# Altium schematic sheet RedundantReg.SchDoc
size A4
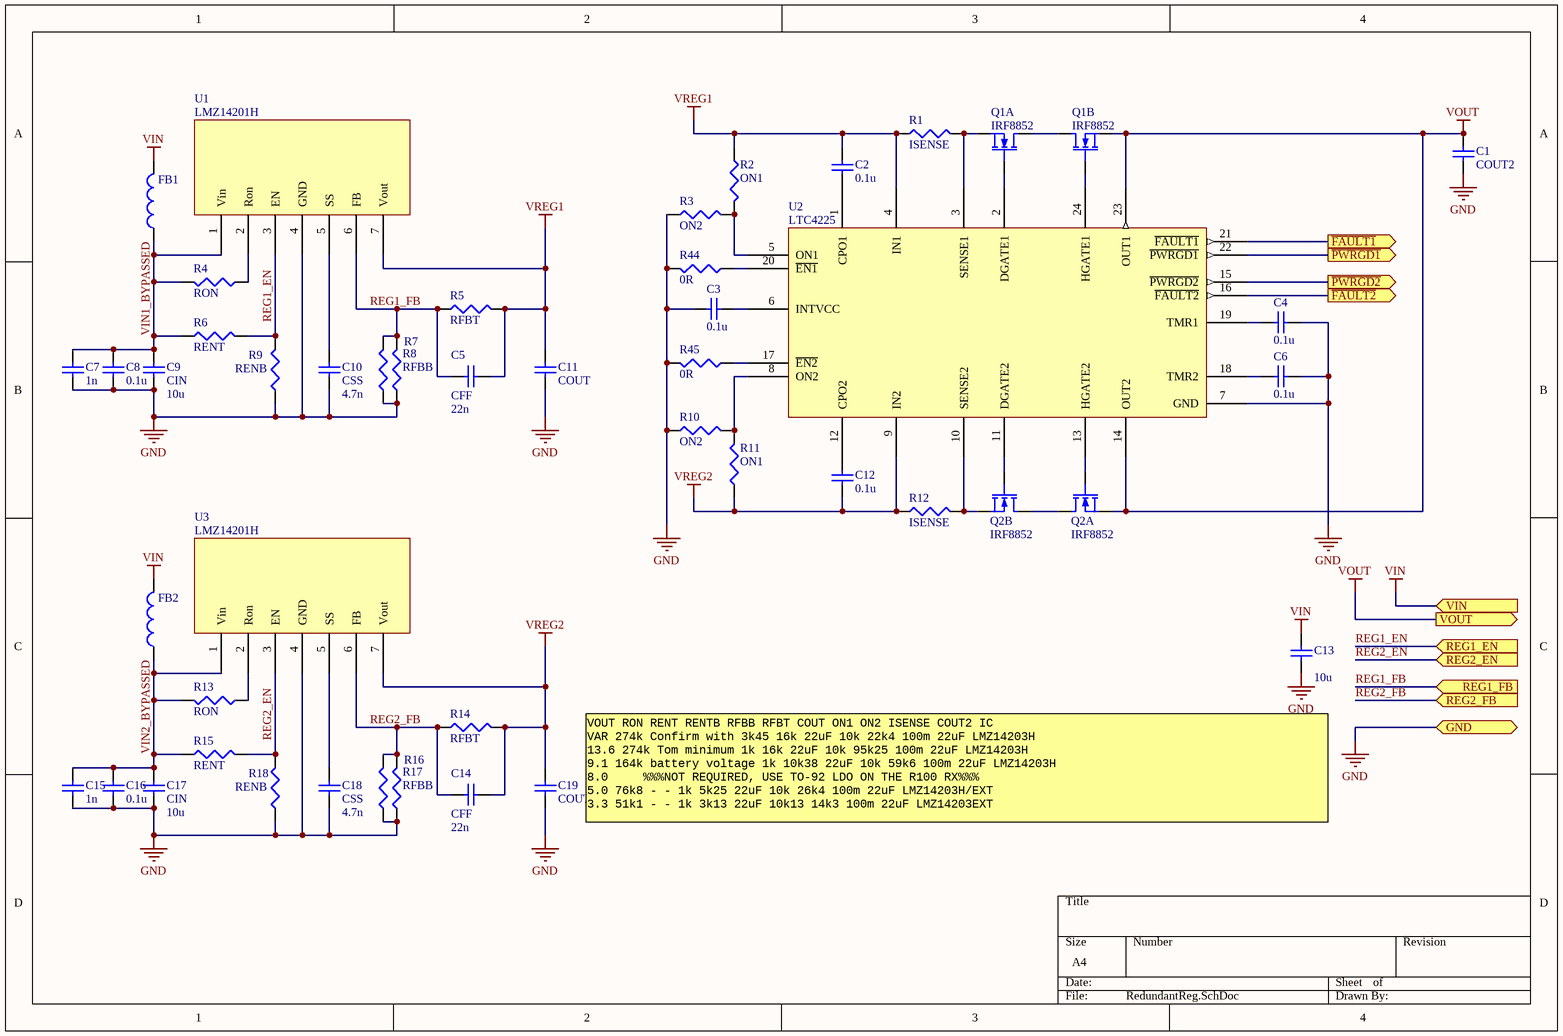
[diagram p0: RedundantReg.SchDoc]

## Parts
C1  COUT2  [R1210M]
C2  value 0.1u  [R0805M]
C3  value 0.1u  [R0805M]
C4  value 0.1u  [R0805M]
C5  CFF  value 22n  [R0805M]
C6  value 0.1u  [R0805M]
C7  value 1n  [R0805M]  (hidden comment: CIN)
C8  value 0.1u  [R0805M]  (hidden comment: CIN)
C9  CIN  value 10u  [R1210M]
C10  CSS  value 4.7n  [R0805M]
C11  COUT  [R1210M]
C12  value 0.1u  [R0805M]
C13  value 10u  [R1210M]
C14  CFF  value 22n  [R0805M]
C15  value 1n  [R0805M]  (hidden comment: CIN)
C16  value 0.1u  [R0805M]  (hidden comment: CIN)
C17  CIN  value 10u  [R1210M]
C18  CSS  value 4.7n  [R0805M]
C19  COUT  [R1210M]
FB1  (no value)  [R0805M]
FB2  (no value)  [R0805M]
Q1  IRF8852  [TSSOP8]  (parts A,B of 2)
Q2  IRF8852  [TSSOP8]  (parts A,B of 2)
R1  ISENSE  [R0805M]
R2  ON1  [R0805M]
R3  ON2  [R0805M]
R4  RON  [R0805M]
R5  RFBT  [R0805M]
R6  RENT  [R0805M]
R7  RFBB  [R0805M]  (value not drawn)
R8  RFBB  [R0805M]
R9  RENB  [R0805M]
R10  ON2  [R0805M]
R11  ON1  [R0805M]
R12  ISENSE  [R0805M]
R13  RON  [R0805M]
R14  RFBT  [R0805M]
R15  RENT  [R0805M]
R16  RFBB  [R0805M]  (value not drawn)
R17  RFBB  [R0805M]
R18  RENB  [R0805M]
R44  value 0R  [R0805M]
R45  value 0R  [R0805M]
U1  LMZ14201H  [TO-PMOD-7]
U2  LTC4225  [SSOP24]
U3  LMZ14201H  [TO-PMOD-7]

## Ports
GND, REG1_EN (in), REG1_FB (in), REG2_EN (in), REG2_FB (in), VIN (in), VOUT (out), ~{FAULT1} (out), ~{FAULT2} (out), ~{PWRGD1} (out), ~{PWRGD2} (out)

## Nets
GND: C1.1 C3.2 C4.1 C6.1 C7.1 C8.1 C9.2 C10.2 C11.1 C13.2 C15.1 C16.1 C17.2 C18.2 C19.1 R3.1 R7.1 R8.1 R9.2 R10.1 R16.1 R17.1 R18.2 R44.2 R45.2 U1.4(GND) U2.7(GND) U3.4(GND) ; port GND
VIN: C13.1 FB1.2 FB2.2 ; port VIN
VOUT: C1.2 Q1.S2(S) Q2.S1(S) U2.14(OUT2) U2.23(OUT1) ; port VOUT
VREG1: C2.1 C5.2 C11.2 R1.1 R2.1 R5.2 U1.7(Vout) U2.4(IN1)
VREG2: C12.2 C14.2 C19.2 R11.1 R12.1 R14.2 U2.9(IN2) U3.7(Vout)
~{FAULT1}: U2.21(~{FAULT1}) ; port ~{FAULT1}
~{FAULT2}: U2.16(~{FAULT2}) ; port ~{FAULT2}
~{PWRGD1}: U2.22(~{PWRGD1}) ; port ~{PWRGD1}
~{PWRGD2}: U2.15(~{PWRGD2}) ; port ~{PWRGD2}
REG1_EN: R6.2 R9.1 U1.3(EN) ; port REG1_EN
REG1_FB: C5.1 R5.1 R7.2 R8.2 U1.6(FB) ; port REG1_FB
REG2_EN: R15.2 R18.1 U3.3(EN) ; port REG2_EN
REG2_FB: C14.1 R14.1 R16.2 R17.2 U3.6(FB) ; port REG2_FB
VIN1_BYPASSED: C7.2 C8.2 C9.1 FB1.1 R4.2 R6.1 U1.1(Vin)
VIN2_BYPASSED: C15.2 C16.2 C17.1 FB2.1 R13.2 R15.1 U3.1(Vin)
NetC2_2: C2.2 U2.1(CPO1)
NetC3_1: C3.1 U2.6(INTVCC)
NetC4_2: C4.2 U2.19(TMR1)
NetC6_2: C6.2 U2.18(TMR2)
NetC10_1: C10.1 U1.5(SS)
NetC12_1: C12.1 U2.12(CPO2)
NetC18_1: C18.1 U3.5(SS)
NetQ1_D1: Q1.D1(D) Q1.D2(D)
NetQ1_G1: Q1.G1(G) U2.2(DGATE1)
NetQ1_G2: Q1.G2(G) U2.24(HGATE1)
NetQ1_S1: Q1.S1(S) R1.2 U2.3(SENSE1)
NetQ2_D1: Q2.D1(D) Q2.D2(D)
NetQ2_G1: Q2.G1(G) U2.13(HGATE2)
NetQ2_G2: Q2.G2(G) U2.11(DGATE2)
NetQ2_S2: Q2.S2(S) R12.2 U2.10(SENSE2)
NetR2_2: R2.2 R3.2 U2.5(ON1)
NetR4_1: R4.1 U1.2(Ron)
NetR10_2: R10.2 R11.2 U2.8(ON2)
NetR13_1: R13.1 U3.2(Ron)
NetR44_1: R44.1 U2.20(~{EN1})
NetR45_1: R45.1 U2.17(~{EN2})

## Notes on the sheet
- VOUT	RON	RENT	RENTB	RFBB	RFBT	COUT	ON1	ON2	ISENSE	COUT2	IC
  VAR	274k	Confirm with	3k45	16k	22uF	10k	22k4	100m	22uF	LMZ14203H
  13.6	274k	Tom minimum	1k	16k	22uF	10k	95k25	100m	22uF	LMZ14203H
  9.1	164k	battery voltage	1k	10k38	22uF	10k	59k6	100m	22uF	LMZ14203H
  8.0     %%%NOT REQUIRED, USE TO-92 LDO ON THE R100 RX%%%
  5.0	76k8	-	-	1k	5k25	22uF	10k	26k4	100m	22uF	LMZ14203H/EXT
  3.3	51k1	-	-	1k	3k13	22uF	10k13	14k3	100m	22uF	LMZ14203EXT

## Library data of the parts
C1 C11 C19 = Cap: Capacitor; Value: 100pF; Published: 8-Jun-2000; LatestRevisionDate: 17-Jul-2002; LatestRevisionNote: Re-released for DXP Platform.; PackageReference: RAD-0.3; Publisher: Altium Limited; PackageDescription: Radial Cap, Thru-Hole; 2 Leads; 0.3 in Pin Spacing
C2-C10 C12-C18 = Cap: Capacitor; Published: 8-Jun-2000; LatestRevisionDate: 17-Jul-2002; LatestRevisionNote: Re-released for DXP Platform.; PackageReference: RAD-0.3; Publisher: Altium Limited; PackageDescription: Radial Cap, Thru-Hole; 2 Leads; 0.3 in Pin Spacing
FB1 FB2 = Inductor: Code_IEC: 1005; Value: 10mH; Published: 8-Jun-2000; LatestRevisionDate: 29-May-2009; LatestRevisionNote: IPC-7351 Footprint Added.; PackageReference: 0402-A; Publisher: Altium Limited; PackageDescription: Chip Inductor; Code_JEITA: 0402
Q1 Q2 = IRF8852: N-Channel MOSFET; Published: 8-Jun-2000; LatestRevisionDate: 17-Jul-2002; LatestRevisionNote: Re-released for DXP Platform.; PackageVersion: 1995/1996; PackageReference: E3; Publisher: Altium Limited; PackageDescription: TO, Flat Index; 3 In-Line, Axial Leads; Body Dia. 4.6mm; Lead Dia. 0.5 mm (max)
R1-R18 = Res3: Resistor; Value: 1K; Published: 8-Jun-2000; LatestRevisionDate: 29-May-2009; LatestRevisionNote: IPC-7351 Footprint Added.; PackageReference: J1-0603; Publisher: Altium Limited; PackageDescription: Chip Resistor
R44 R45 = Res3: Resistor; Published: 8-Jun-2000; LatestRevisionDate: 29-May-2009; LatestRevisionNote: IPC-7351 Footprint Added.; PackageReference: J1-0603; Publisher: Altium Limited; PackageDescription: Chip Resistor
U1 U3 = LMZ14201H: 1A SIMPLE SWITCHER® Power Module for High Output  Voltage
U2 = LTC4225: Dual Ideal Diode and  Hot Swap Controller